# Altium schematic sheet Vref.SchDoc
size A4
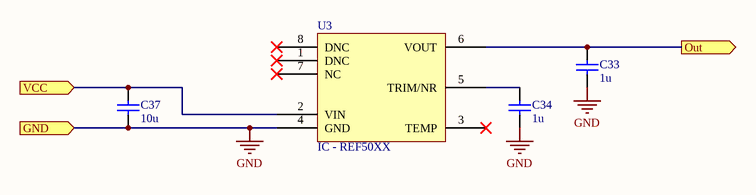
[diagram p0: Vref.SchDoc]

## Parts
C33  value 1u  [CS-0603]  (hidden comment: CS - CAPACITOR)
C34  value 1u  [CS-0603]  (hidden comment: CS - CAPACITOR)
C37  value 10u  [CS-0603]  (hidden comment: CS - CAPACITOR)
U3  IC - REF50XX  [IC-SOIC-8]

## Ports
GND (in), Out (out), VCC (in)

## Nets
GND: C33.1 C34.1 C37.1 U3.4(GND) ; port GND
Out: C33.2 U3.6(VOUT) ; port Out
VCC: C37.2 U3.2(VIN) ; port VCC
NetC34_2: C34.2 U3.5(TRIM/NR)

Not connected (* = marked no-connect by the designer): U3 1(DNC)* 3(TEMP)* 7(NC)* 8(DNC)*

## Library data of the parts
C33 C34 C37 = CS - CAPACITOR: TOLERANCE: 10%; VOLTAGE: 16V; Supplier 1: *; Supplier Part Number 1: *; (FIELD A): *; (FLIED C): *; (FIELD B): *; Manufacturer: *
U3 = IC - REF50XX: VOLTAGE REFERENCE